# EAGLE design tiny_rack_v2_psu_core (EAGLE 9.6.2)

## Sheet 1 of 2
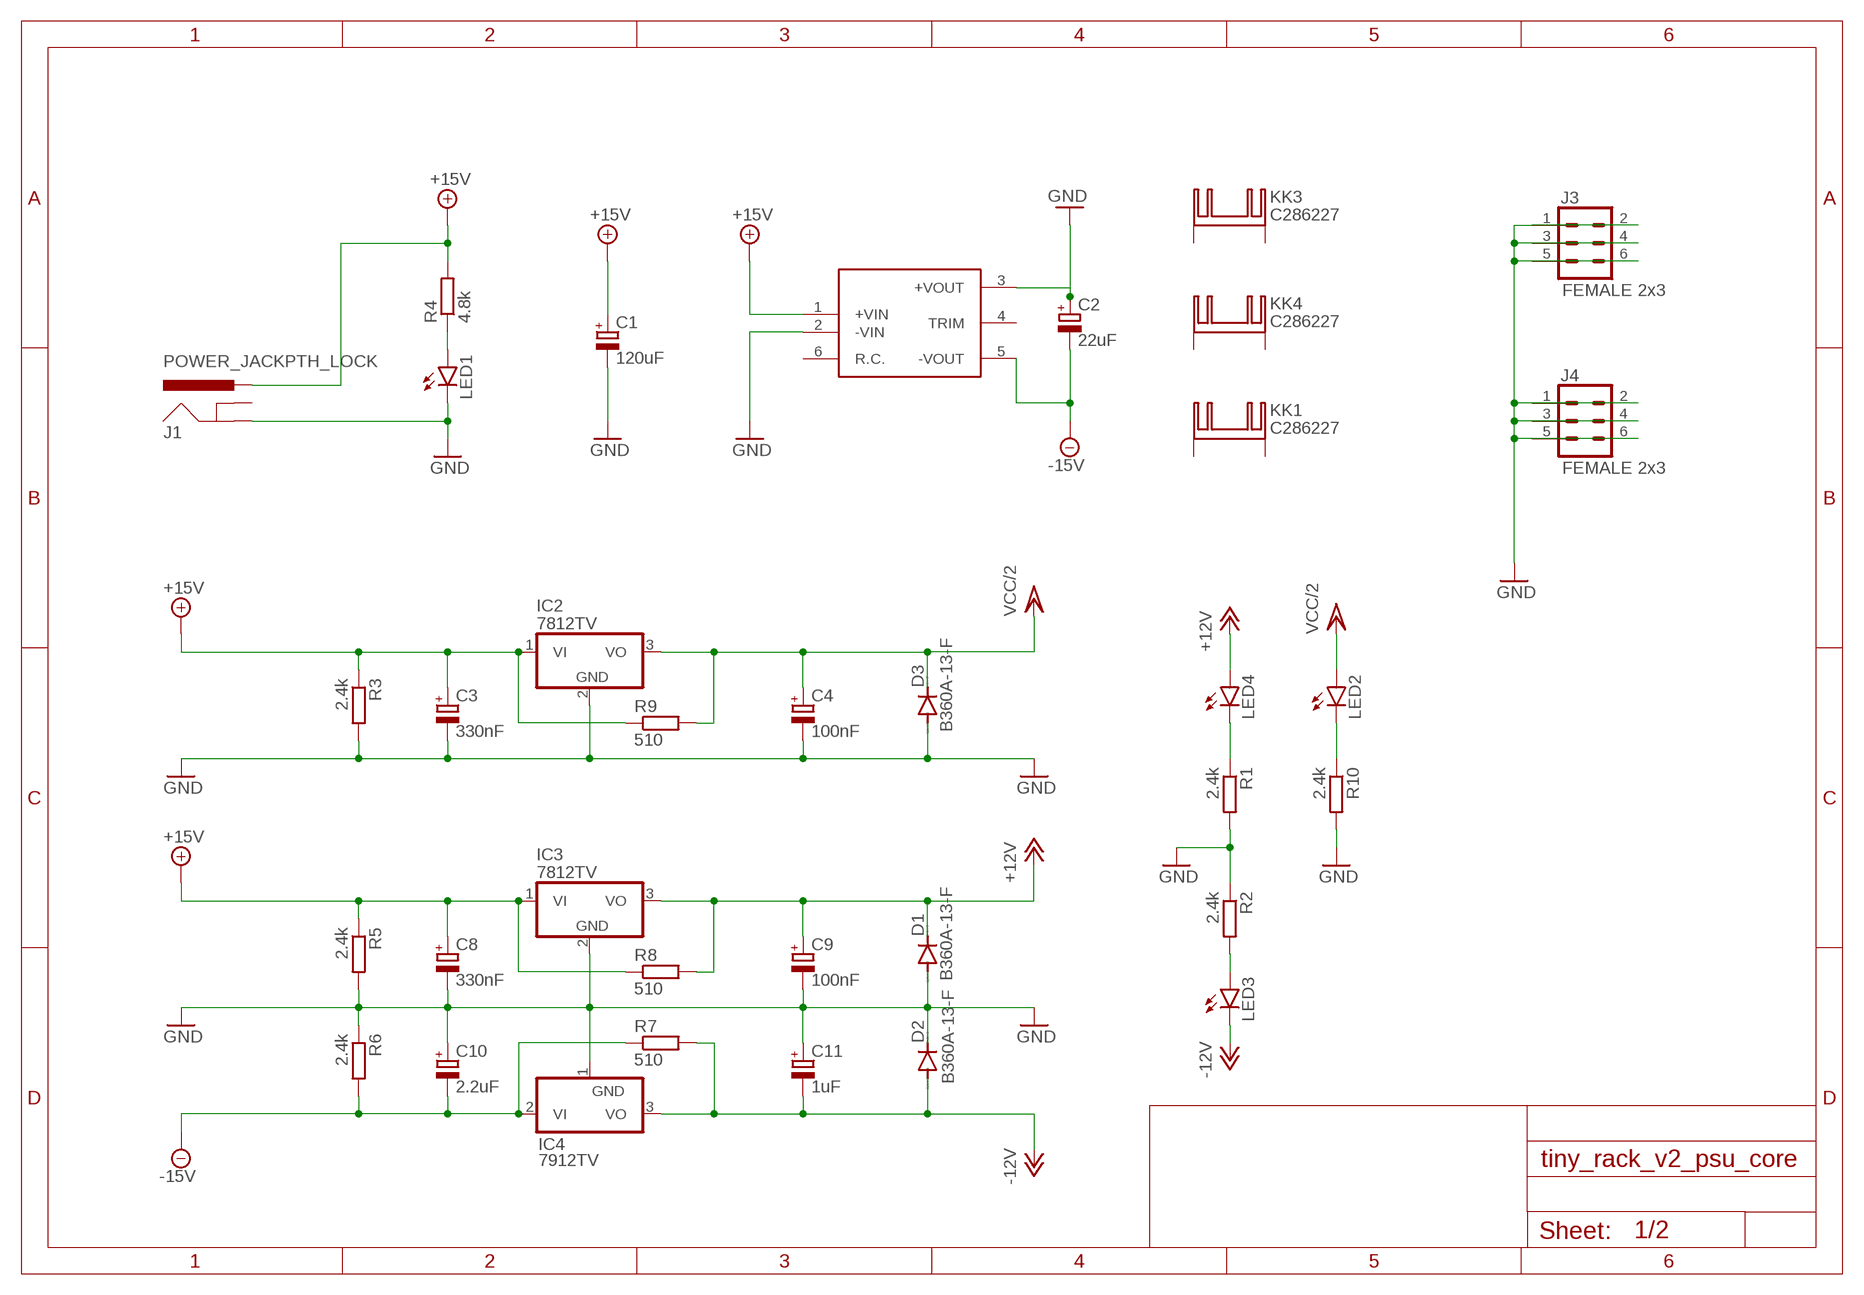
[diagram p0: schematic, sheet 1]

### Parts
C1  120uF  CPOL-EUE5-10.5  [E5-10,5]
C2  22uF  CPOL-EUE2.5-6  [E2,5-6]
C3  330nF  C-POL_TANTALUM-1206(3216-METRIC)  [CAPMP3216X180N]
C4  100nF  C-POL_TANTALUM-1206(3216-METRIC)  [CAPMP3216X180N]
C8  330nF  C-POL_TANTALUM-1206(3216-METRIC)  [CAPMP3216X180N]
C9  100nF  C-POL_TANTALUM-1206(3216-METRIC)  [CAPMP3216X180N]
C10  2.2uF  C-POL_TANTALUM-1411(3528-METRIC)  [CAPMP3528X210N]
C11  1uF  C-POL_TANTALUM-1206(3216-METRIC)  [CAPMP3216X180N]
D1  B360A-13-F  DIODE-DO-214AC  [DO-214AC]
D2  B360A-13-F  DIODE-DO-214AC  [DO-214AC]
D3  B360A-13-F  DIODE-DO-214AC  [DO-214AC]
IC1  SKMW  [SKMW]
IC2  7812TV  [TO220V]
IC3  7812TV  [TO220V]
IC4  7912TV  [TO220V]
J1  POWER_JACKPTH_LOCK  [POWER_JACK_PTH_LOCK]
J3  FEMALE 2x3  CONN_03X2FEMALE  [2X3]
J4  FEMALE 2x3  CONN_03X2FEMALE  [2X3]
KK1  C286227  [C286227]
KK3  C286227  [C286227]
KK4  C286227  [C286227]
LED1  LEDCHIP-LED0805  [CHIP-LED0805]
LED2  LEDCHIP-LED0805  [CHIP-LED0805]
LED3  LEDCHIP-LED0805  [CHIP-LED0805]
LED4  LEDCHIP-LED0805  [CHIP-LED0805]
R1  2.4k  R-EU_R0805  [R0805]
R2  2.4k  R-EU_R0805  [R0805]
R3  2.4k  R-EU_R0805  [R0805]
R4  4.8k  R-EU_R0805  [R0805]
R5  2.4k  R-EU_R0805  [R0805]
R6  2.4k  R-EU_R0805  [R0805]
R7  510  R-EU_R0805  [R0805]
R8  510  R-EU_R0805  [R0805]
R9  510  R-EU_R0805  [R0805]
R10  2.4k  R-EU_R0805  [R0805]

### Nets
+12V: C9.1(+) D1.C IC3.3(VO) LED4.A R8.2 ; also sheet 2
+15V: C1.+ C3.1(+) C8.1(+) IC1.1(+VIN) IC2.1(VI) IC3.1(VI) J1.PWR R3.1 R4.2 R5.1 R8.1 R9.1 ; also sheet 2
-12V: C11.2(-) D2.A IC4.3(VO) LED3.C R7.2 ; also sheet 2
-15V: C2.- C10.2(-) IC1.5(-VOUT) IC4.2(VI) R6.2 R7.1
GND: C1.- C2.+ C3.2(-) C4.2(-) C8.2(-) C9.2(-) C10.1(+) C11.1(+) D1.A D2.C D3.A IC1.2(-VIN) IC1.3(+VOUT) IC2.2(GND) IC3.2(GND) IC4.1(GND) J1.GND J3.1 J3.2 J3.3 J3.4 J3.5 J3.6 J4.1 J4.2 J4.3 J4.4 J4.5 J4.6 LED1.C R1.2 R2.1 R3.2 R5.2 R6.1 R10.2 ; also sheet 2
N$1: LED4.C R1.1
N$2: LED2.C R10.1
N$3: LED3.A R2.2
N$7: LED1.A R4.1
VCC/2: C4.1(+) D3.C IC2.3(VO) LED2.A R9.2 ; also sheet 2
Unconnected: IC1.4(TRIM) IC1.6(R.C.) J1.GNDBREAK KK1.A2,2(K) KK1.B2,2(K) KK3.A2,2(K) KK3.B2,2(K) KK4.A2,2(K) KK4.B2,2(K)

## Sheet 2 of 2
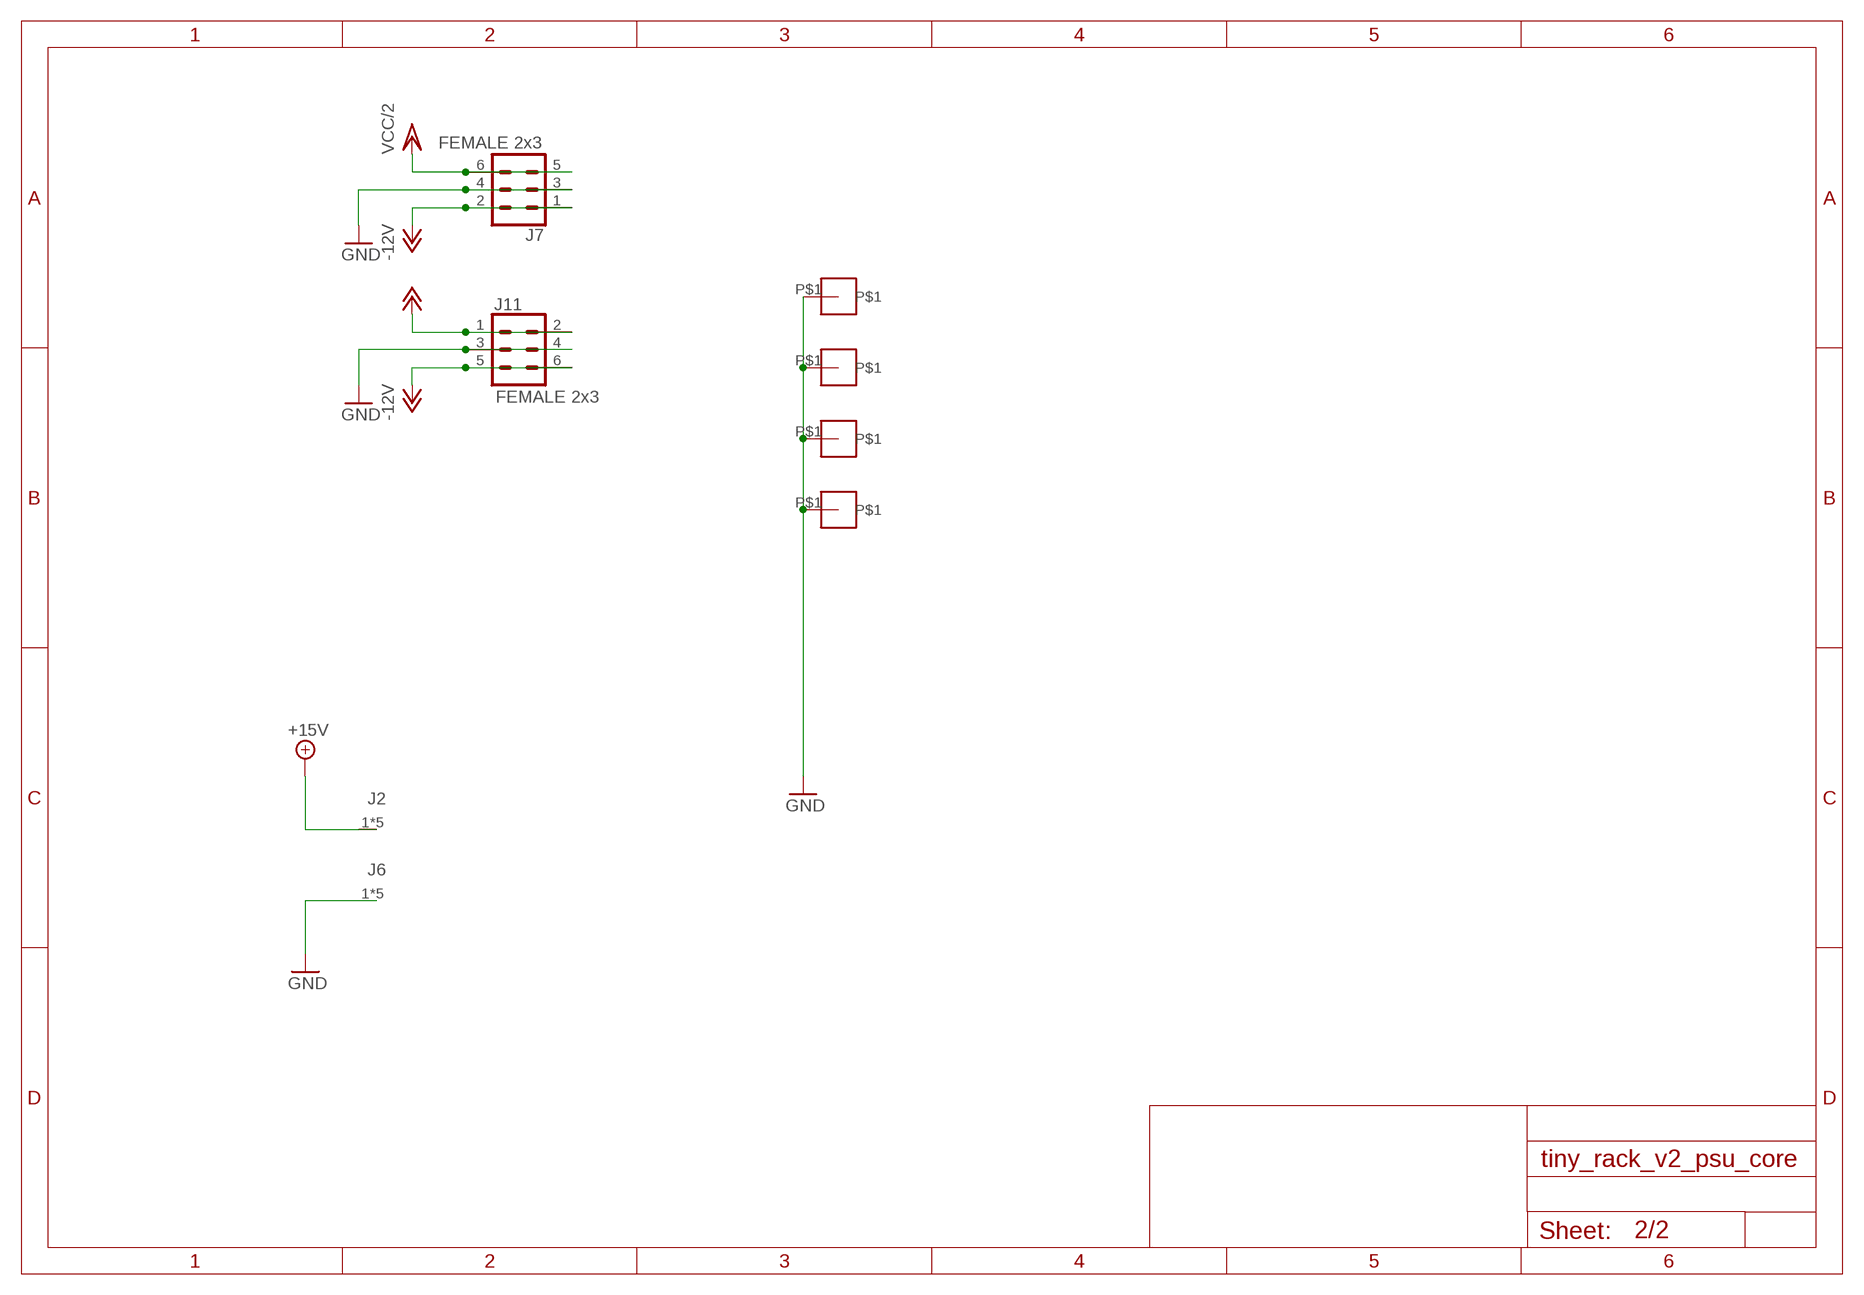
[diagram p1: schematic, sheet 2]

### Parts
J2  30A-SCREW-CONN  [50X72]
J6  30A-SCREW-CONN  [50X72]
J7  FEMALE 2x3  CONN_03X2FEMALE  [2X3]
J11  FEMALE 2x3  CONN_03X2FEMALE  [2X3]
U$3  M3-HOLE  [M3-HOLE]
U$4  M3-HOLE  [M3-HOLE]
U$5  M3-HOLE  [M3-HOLE]
U$6  M3-HOLE  [M3-HOLE]

### Nets
+12V: J11.1 J11.2 ; also sheet 1
+15V: J2.1 J2.2 J2.3 J2.4 J2.P$1 ; also sheet 1
-12V: J7.1 J7.2 J11.5 J11.6 ; also sheet 1
GND: J6.1 J6.2 J6.3 J6.4 J6.P$1 J7.3 J7.4 J11.3 J11.4 U$3.P$1 U$4.P$1 U$5.P$1 U$6.P$1 ; also sheet 1
VCC/2: J7.5 J7.6 ; also sheet 1

## Library data of the parts
C1 C2 = rcl:CPOL-EU: POLARIZED CAPACITOR, European symbol; SPICEPREFIX: C
C3 C4 C8-C11 = Capacitor:C-POL: Capacitor Polarised - Generic; CATEGORY: Capacitor
D1-D3 = diode:DIODE-: DIODE
IC1 = meanwell_dcdc:SKMW
IC2 IC3 = ldo:78*: Positive VOLTAGE REGULATOR Source: http://cache.national.com/ds/LM/LM78L05.pdf http://www.fairchildsemi.com/ds/LM/LM7805.pdf
IC4 = ldo:79*: Positive VOLTAGE REGULATOR Source: http://cache.national.com/ds/LM/LM78L05.pdf http://www.fairchildsemi.com/ds/LM/LM7805.pdf
J1 = SparkFun-Connectors:POWER_JACK: Power Jack Connector This is the standard 5.5mm barrel jack for power. The PTH is the most common, proven, reliable, footprint. The Slot footprint only works if the mill layer is transmitted to the PCB fab house so be warned. Here are the connectors we sell at SparkFun: DC Barrel Power Jack/Connector <https://www.sparkfun.com/products/119> (PRT-00119) DC Barrel Power Jack/Connector (SMD) <https://www.sparkfun.com/products/12748> (PRT-12748) DC Barrel Jack Adapter - Breadboard Compatible <https://www.sparkfun.com/products/10811> (PRT-10811) It is used on this SparkFun product (and many, many others): SparkFun RedBoard - Programmed with Arduino <https://www.sparkfun.com/products/12757> (DEV-12757) Also, if you need a mating power supply or connector, please check these out: Wall Adapter Power Supply - 9VDC 650mA <https://www.sparkfun.com/products/298> (TOL-00298) DC Barrel Jack Adapter - Male <https://www.sparkfun.com/products/10287> (PRT-10287); PROD_ID: CONN-08197; SF_ID: PRT-00119
J2 J6 = conn-screw:30A-SCREW-CONN
J3 J4 J7 J11 = SparkFun-Connectors:CONN_03X2: Multi connection point. Often used as Generic Header-pin footprint for 0.1 inch spaced/style header connections You can populate with any combo of single row headers, but if you'd like an exact match, check these: Header - 2x3 (Male, 0.1") <https://www.sparkfun.com/products/12807> (PRT-12807) Header - 2x3 (Female, 0.1") <https://www.sparkfun.com/products/13010> (PRT-13010) 2x3 Pin Shrouded Header <https://www.sparkfun.com/products/10877> (PRT-10877) On any of the 0.1 inch spaced packages, you can populate with these: Break Away Headers - Straight <https://www.sparkfun.com/products/116> (PRT-00116) Break Away Male Headers - Right Angle <https://www.sparkfun.com/products/553> (PRT-00553) Female Headers <https://www.sparkfun.com/products/115> (PRT-00115) Break Away Headers - Machine Pin <https://www.sparkfun.com/products/117> (PRT-00117) Break Away Female Headers - Swiss Machine Pin <https://www.sparkfun.com/products/743> (PRT-00743) Special note: the shrouded connector mates well with our 3x2 ribbon cables: Ribbon Crimp Connector - 6-pin (2x3, Female) <https://www.sparkfun.com/products/10651> (PRT-10651) Ribbon Cable - 6 wire (15ft) <https://www.sparkfun.com/products/10646> (PRT-10646); PROD_ID: CONN-11566
KK1 KK3 KK4 = biti:C286227: HEATSINK manufacturer Fischer/distributor Buerklin
LED1-LED4 = led:LED: LED OSRAM: - CHIPLED LG R971, LG N971, LY N971, LG Q971, LY Q971, LO R971, LY R971 LH N974, LH R974 LS Q976, LO Q976, LY Q976 LO Q996 - Hyper CHIPLED LW Q18S LB Q993, LB Q99A, LB R99A - SideLED LS A670, LO A670, LY A670, LG A670, LP A670 LB A673, LV A673, LT A673, LW A673 LH A674 LY A675 LS A676, LA A676, LO A676, LY A676, LW A676 LS A679, LY A679, LG A679 - Hyper Micro SIDELED® LS Y876, LA Y876, LO Y876, LY Y876 LT Y87S - SmartLED LW L88C, LW L88S LB L89C, LB L89S, LG L890 LS L89K, LO L89K, LY L89K LS L896, LA L896, LO L896, LY L896 - TOPLED LS T670, LO T670, LY T670, LG T670, LP T670 LSG T670, LSP T670, LSY T670, LOP T670, LYG T670 LG T671, LOG T671, LSG T671 LB T673, LV T673, LT T673, LW T673 LH T674 LS T676, LA T676, LO T676, LY T676, LB T676, LH T676, LSB T676, LW T676 LB T67C, LV T67C, LT T67C, LS T67K, LO T67K, LY T67K, LW E67C LS E67B, LA E67B, LO E67B, LY E67B, LB E67C, LV E67C, LT E67C LW T67C LS T679, LY T679, LG T679 LS T770, LO T770, LY T770, LG T770, LP T770 LB T773, LV T773, LT T773, LW T773 LH T774 LS E675, LA E675, LY E675, LS T675 LS T776, LA T776, LO T776, LY T776, LB T776 LHGB T686 LT T68C, LB T68C - Hyper Mini TOPLED® LB M676 - Mini TOPLED Santana® LG M470 LS M47K, LO M47K, LY M47K Source: http://www.osram.convergy.de LUXEON: - LUMILED® LXK2-PW12-R00, LXK2-PW12-S00, LXK2-PW14-U00, LXK2-PW14-V00 LXK2-PM12-R00, LXK2-PM12-S00, LXK2-PM14-U00 LXK2-PE12-Q00, LXK2-PE12-R00, LXK2-PE12-S00, LXK2-PE14-T00, LXK2-PE14-U00 LXK2-PB12-K00, LXK2-PB12-L00, LXK2-PB12-M00, LXK2-PB14-N00, LXK2-PB14-P00, LXK2-PB14-Q00 LXK2-PR12-L00, LXK2-PR12-M00, LXK2-PR14-Q00, LXK2-PR14-R00 LXK2-PD12-Q00, LXK2-PD12-R00, LXK2-PD12-S00 LXK2-PH12-R00, LXK2-PH12-S00 LXK2-PL12-P00, LXK2-PL12-Q00, LXK2-PL12-R00 Source: www.luxeon.com KINGBRIGHT: KA-3528ASYC Source: www.kingbright.com
R1-R10 = rcl:R-EU_: RESISTOR, European symbol; SPICEPREFIX: R
U$3-U$6 = biti:M3-HOLE

## Board
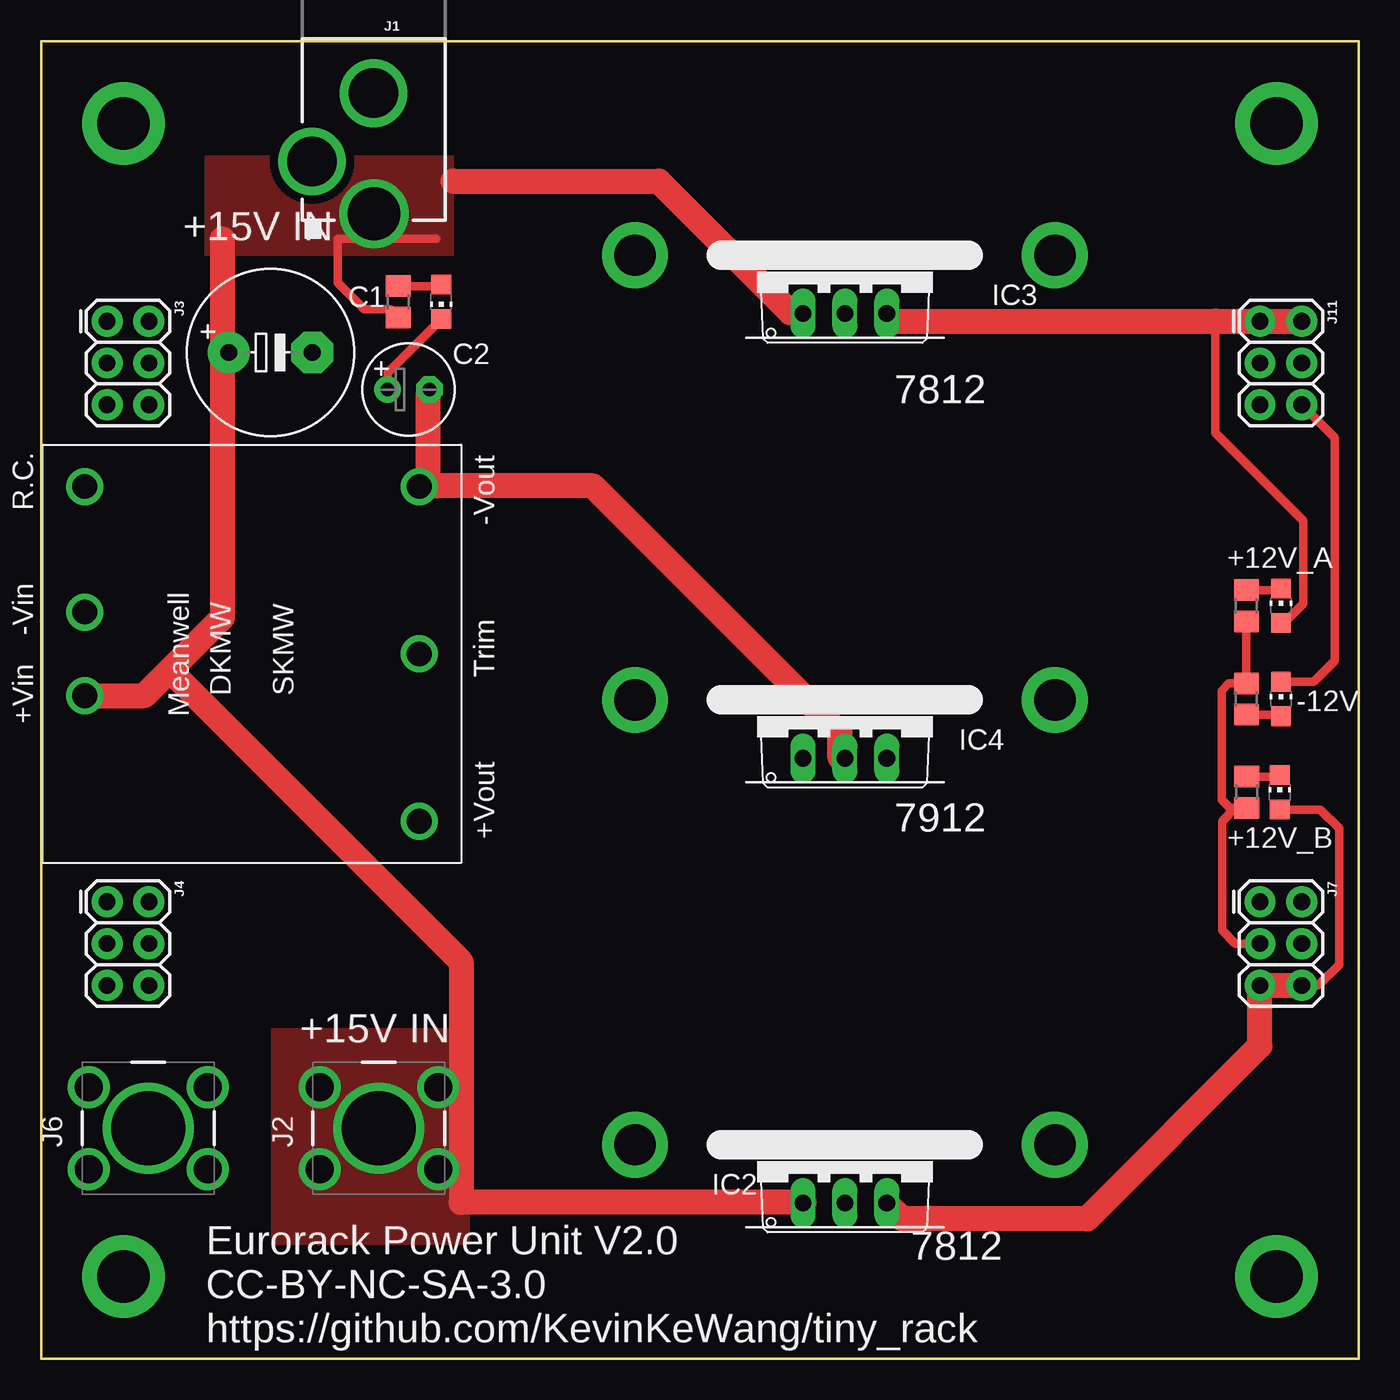
[diagram p2: board, top side]
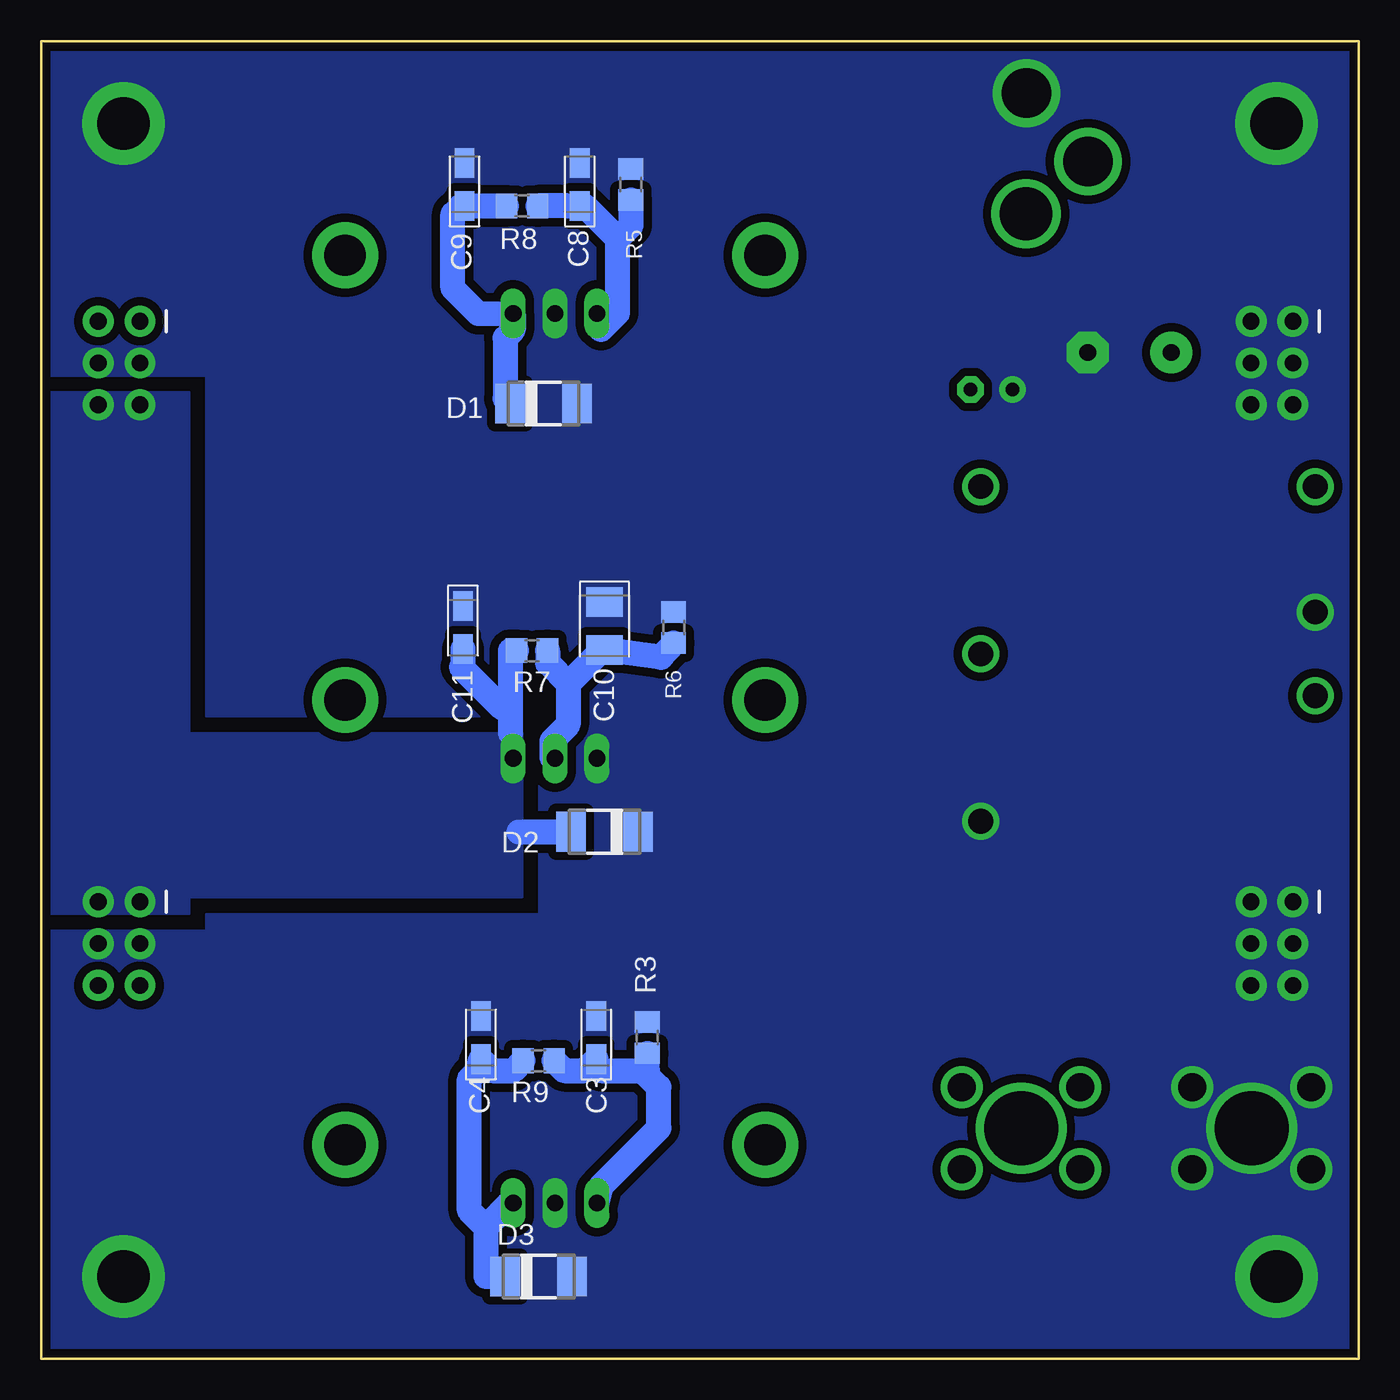
[diagram p3: board, bottom side, seen from below]

Size 80 x 80 mm. Coordinates in mm from the lower left corner, seen from the top.
Outline: 0,0 80,0 80,80 0,80 0,0
Copper layers (1+2*15+16): Top 0.035mm / dielectric 0.3mm / Route2 0.035mm / dielectric 0.75mm / Route15 0.035mm / dielectric 0.3mm / Bottom 0.035mm
Design rules "default *": minimum track width 20mil, minimum drill 0.35mm, track to track 20mil, track to pad 20mil, pad to pad 20mil, via to via 20mil, smd to smd 6mil, copper to edge 20mil, drill to drill 6mil, minimum pad ring 10mil, minimum via ring 8mil, stop-mask expansion 4mil, vias tented up to drill 0mil, thermal gap 10mil

### Footprints (pad centres in the part's own frame; a part is rotated, then mirrored left to right if it is on the bottom)
E5-10,5 = drill 1.016 pad 2.54: + -2.54,0 | drill 1.016 pad 2.54 octagon: - 2.54,0
E2,5-6 = drill 0.813 pad 1.6: + -1.27,0 | drill 0.813 pad 1.6 octagon: - 1.27,0
CAPMP3216X180N = smd 1.796 x 1.189: 1 -1.31,0; 2 1.31,0
CAPMP3528X210N = smd 1.796 x 2.204: 1 -1.46,0; 2 1.46,0
DO-214AC = smd 1.8 x 2.4: A 2.025,0; C -2.025,0
SKMW = drill 1.5: 1 -2.54,10.16; 2 2.54,10.16; 3 -10.16,-10.16; 4 0,-10.16; 5 10.16,-10.16; 6 10.16,10.16
TO220V = drill 1.016 long: 1 -2.54,-2.54; 2 0,-2.54; 3 2.54,-2.54
POWER_JACK_PTH_LOCK = drill 2.997 pad 4.115: GND 0.025,6.557; GNDBREAK 3.762,10.7 | drill 3.2 pad 4.115: PWR 0,13.878
50X72 = drill 1.7: 1 -2.5,3.6; 2 2.5,3.6; 3 2.5,-3.6; 4 -2.5,-3.6 | drill 4.5: P$1 0,0
2X3 = drill 1.016 pad 1.88: 1 0,0; 2 0,2.54; 3 2.54,0; 4 2.54,2.54; 5 5.08,0; 6 5.08,2.54
C286227 = drill 2.5 pad 4: A2,2 -12.75,0; B2,2 12.75,0
CHIP-LED0805 = smd 1.2 x 1.2: A 0,-1.05; C 0,1.05
R0805 = smd 1.3 x 1.5: 1 -0.95,0; 2 0.95,0
M3-HOLE = drill 3.2 pad 5: P$1 0,0

### Placement (x,y rotation side)
C1  13.93,61.1 0 top
C2  22.3,58.85 0 top
C3  46.3,19.5 90 bottom
C4  53.3,19.5 90 bottom
C8  47.3,71.3 90 bottom
C9  54.3,71.3 90 bottom
C10  45.8,44.5 270 bottom
C11  54.4,44.4 270 bottom
D1  49.5,58 0 bottom
D2  45.8,32 180 bottom
D3  49.8,5 0 bottom
IC1  12.8,42.8 90 top
IC2  48.8,12 0 top
IC3  48.8,66 0 top
IC4  48.8,39 0 top
J1  20.2,83.4 180 top
J2  20.5,14 90 top
J3  4,63 270 top
J4  4,27.75 270 top
J6  6.5,14 90 top
J7  74,27.75 270 top
J11  74,63 270 top
KK1  48.8,13 0 top
KK3  48.8,40 0 top
KK4  48.8,67 0 top
LED1  24.29,64.18 180 top
LED2  75.2,34.4 0 top
LED3  75.28,40.06 0 top
LED4  75.28,45.72 0 top
R1  73.18,45.72 270 top
R2  73.18,40.06 270 top
R3  43.2,19.5 90 bottom
R4  21.68,64.18 270 top
R5  44.2,71.3 90 bottom
R6  41.6,44.4 270 bottom
R7  50.2,43 180 bottom
R8  50.8,70 180 bottom
R9  49.8,18.1 180 bottom
R10  73.2,34.4 270 top
U$3  5,5 0 top
U$4  75,5 0 top
U$5  5,75 0 top
U$6  75,75 0 top

### Tracks (layer width: path | path; a pad name or v marks a point on that pad's centre or on a via)
+12V
  Top 0.508: LED4.A 75.45,44.67 76.64,45.85 76.64,50.88 71.3,56.22 71.3,63
  Top 1.524: IC3.3 51.39,63 71.3,63 J11.1 J11.2
  Bottom 1.5: IC3.3 53.46,63.46 55,65
  Bottom 1.524: R8.2 C9.1 54.51,69.99 55,69.5 55,65 | D1.C 51.83,58.3 51.83,61.97 51.34,62.46 IC3.3
+15V
  Top 0.508: R4.2 21.2,63.71 19.62,63.71 18,65.33 18,68 24,68
  Top 1.524: IC3.1 46.22,63.5 45.5,63.5 37.5,71.5 25,71.5 | IC2.1 46.3,9.5 25.5,9.5 25.5,24.1 7.8,41.8 | 7.8,41.8 11,45 11,61 C1.+ 11,61.48 11,68 | 7.8,41.8 6.26,40.26 IC1.1
  Bottom 1.524: 45,68 44.2,68.8 R5.1 | 45,68 47,70 C8.1 48,70 R8.1 | 45,68 45,63.5 46,62.5 IC3.1 | 43.5,17.5 46,17.5 46.5,18 | 43.5,17.5 43.2,17.55 R3.1 | 46.5,18 47.01,17.51 47,17.5 48.25,17.5 R9.1 | 46.5,18 C3.1 | 43.5,17.5 42.5,16.5 42.5,14 46,10.5 IC2.1
  pour Top (no thermals): 10,73 25,73 25,67 10,67
  pour Top (no thermals): 14,20 14,7 26,7 26,20
-12V
  Top 0.508: J11.6 78.54,55.92 78.54,42.37 77.28,41.11 LED3.C
  Bottom 1.524: 51.5,38 51.5,39.5 | 51.5,39.5 51.5,43 R7.2 | C11.2 54.4,42.09 54.49,41.99 52,39.5 51.5,39.5 | 51,32 D2.A
  pour Bottom (no thermals): 50.8,38 50.8,28 71,28 71,27 80,27 80,58.7 71,58.7 71,38
-15V
  Top 1.524: C2.- 23.5,58.5 23.5,53.5 IC1.5 24,53 33.5,53 48.5,38 48.5,36.5 IC4.2
  Bottom 1.524: R6.2 42.37,42.58 C10.2 46,43 48,41 | R7.1 49.25,42.25 48,41 | 48,41 48,38.5 49,37.5 49,36.5 IC4.2
GND
  Top 0.508: R1.2 R2.1 73.16,41.02 72.11,41.02 71.66,40.58 71.66,33.94 72.15,33.45 R10.2 | 73.1,33.45 R10.2 | LED1.C 21.03,59.87 C2.+ | R10.2 72.5,33.45 71.7,32.65 71.7,26.01 72.5,25.21 J7.3
  pour Bottom (no thermals): 0,80 80,80 80,59.7 70,59.7 70,39 49.8,39 49.8,27 70,27 70,26 80,26 80,0 0,0
N$1
  Top 0.508: R1.1 75.18,46.67 LED4.C
N$2
  Top 0.508: R10.1 75.1,35.35 LED2.C
N$3
  Top 0.508: R2.2 75.18,39.11 LED3.A
N$7
  Top 0.508: R4.1 24.18,65.13 LED1.A
VCC/2
  Top 0.508: J7.6 77.54,22.67 78.8,23.93 78.8,32.2 77.65,33.35 LED2.A
  Top 1.524: IC2.3 52.3,8.5 63.5,8.5 74,19 J7.5 J7.6
  Bottom 1.524: R9.2 51.35,17.5 52.61,17.5 C4.1 53.5,17.5 54,17 54,9 53,8 | D3.C 53,5 53,8 | 53,8 51.39,9.61 IC2.3

### Text on the board
tNames: +15V IN | 7812 | +12V_A | -12V | 7912 | +12V_B | +15V IN | 7812 | Eurorack Power Unit V2.0 / CC-BY-NC-SA-3.0 / https://github.com/KevinKeWang/tiny_rack